# EAGLE design PIZ-Dual v886 (EAGLE 7.6.0)
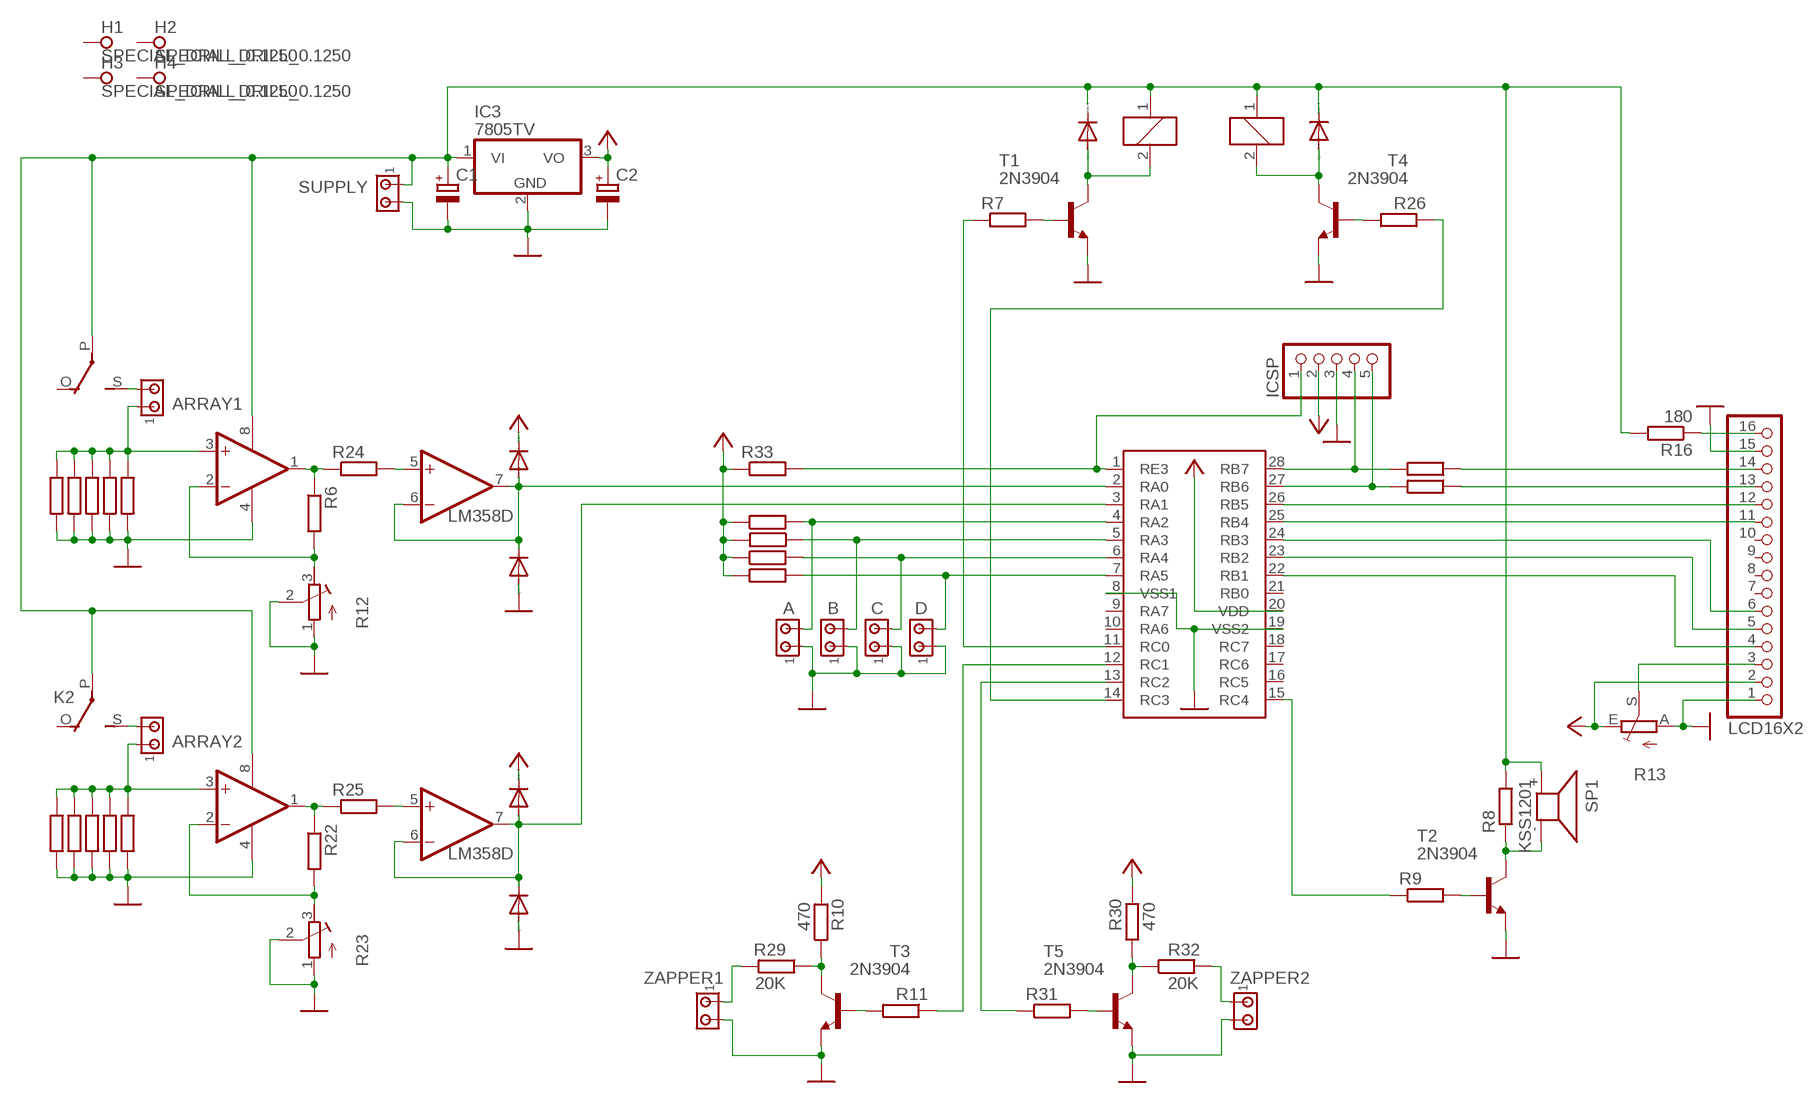
[diagram p0: schematic, sheet 1]

## Parts
A  MTA02-100  [10X02MTA]
ARRAY1  MTA02-100  [10X02MTA]
ARRAY2  MTA02-100  [10X02MTA]
B  MTA02-100  [10X02MTA]
C  MTA02-100  [10X02MTA]
C1  CPOL-EUE2.5-7  [E2,5-7]
C2  CPOL-EUE2.5-7  [E2,5-7]
D  MTA02-100  [10X02MTA]
D1  1N4148DO35-7  [DO35-7]
D2  1N4148DO35-7  [DO35-7]
D3  1N4148DO35-7  [DO35-7]
D4  1N4148DO35-7  [DO35-7]
D5  1N4148DO35-7  [DO35-7]
D6  1N4148DO35-7  [DO35-7]
H1  SPECIAL_DRILL_0.1250  [PAD_0.1250]
H2  SPECIAL_DRILL_0.1250  [PAD_0.1250]
H3  SPECIAL_DRILL_0.1250  [PAD_0.1250]
H4  SPECIAL_DRILL_0.1250  [PAD_0.1250]
IC2  LM358D  [SO08]
IC3  7805TV  [TO220V]
IC4  LM358D  [SO08]
ICSP  PINHD-1X55X2MM  [1_05X2MM]
K1  G5L  [G5LE]
K2  G5L  [G5LE]
LCD16X2  PINHD-1X16  [1X16]
R1  R-EU_R1210  [R1210]
R2  R-EU_R1210  [R1210]
R3  R-EU_R1210  [R1210]
R4  R-EU_R1210  [R1210]
R5  R-EU_R1210  [R1210]
R6  R-EU_R1206  [R1206]
R7  R-EU_R1206  [R1206]
R8  R-EU_R1210  [R1210]
R9  R-EU_R1206  [R1206]
R10  470  R-EU_R1206  [R1206]
R11  R-EU_R1206  [R1206]
R12  R-TRIMM64W  [RTRIM64W]
R13  TRIM_EU-CA6V  [CA6V]
R14  R-EU_R1206  [R1206]
R15  R-EU_R1206  [R1206]
R16  180  R-EU_R2512  [R2512]
R17  R-EU_R1210  [R1210]
R18  R-EU_R1210  [R1210]
R19  R-EU_R1210  [R1210]
R20  R-EU_R1210  [R1210]
R21  R-EU_R1210  [R1210]
R22  R-EU_R1206  [R1206]
R23  R-TRIMM64W  [RTRIM64W]
R24  R-EU_R1206  [R1206]
R25  R-EU_R1206  [R1206]
R26  R-EU_R1206  [R1206]
R27  R-EU_R1206  [R1206]
R28  R-EU_R1206  [R1206]
R29  20K  R-EU_R1206  [R1206]
R30  470  R-EU_R1206  [R1206]
R31  R-EU_R1206  [R1206]
R32  20K  R-EU_R1206  [R1206]
R33  R-EU_R1206  [R1206]
R34  R-EU_R1206  [R1206]
R35  R-EU_R1206  [R1206]
SP1  KSS1201  [KSS1201]
SUPPLY  MTA02-100  [10X02MTA]
T1  2N3904  [TO92]
T2  2N3904  [TO92]
T3  2N3904  [TO92]
T4  2N3904  [TO92]
T5  2N3904  [TO92]
U$1  PIC16F88  [SO28W]
ZAPPER1  MTA02-100  [10X02MTA]
ZAPPER2  MTA02-100  [10X02MTA]

## Nets
GND: A.1 B.1 C1.- C2.- C.1 D2.A D5.A D.1 IC2.4(P:V-) IC3.2(GND) IC4.4(P:V-) ICSP.3 LCD16X2.1 LCD16X2.15 R1.2 R2.2 R3.2 R4.2 R5.2 R12.1(A) R12.2(S) R13.A R17.2 R18.2 R19.2 R20.2 R21.2 R23.1(A) R23.2(S) SUPPLY.2 T1.3(E) T2.3(E) T3.3(E) T4.3(E) T5.3(E) U$1.8(VSS1) U$1.19(VSS2) ZAPPER1.2 ZAPPER2.2
N$1: ARRAY1.1 IC2.3(A:+IN) R1.1 R2.1 R3.1 R4.1 R5.1
N$2: ARRAY1.2 K1.S(2:S)
N$3: IC2.1(A:OUT) R6.1 R24.1
N$4: IC2.2(A:-IN) R6.2 R12.3(E)
N$5: R8.1 SP1.- T2.1(C)
N$6: D1.A D2.C IC2.6(B:-IN) IC2.7(B:OUT) U$1.2(RA0)
N$7: D3.A K1.2 T1.1(C)
N$8: R29.2 ZAPPER1.1
N$9: R7.2 T1.2(B)
N$10: R9.2 T2.2(B)
N$11: R11.2 T3.2(B)
N$12: R9.1 U$1.15(RC4)
N$13: LCD16X2.4 U$1.22(RB1)
N$14: R7.1 U$1.11(RC0)
N$15: LCD16X2.14 R27.1
N$16: LCD16X2.13 R28.1
N$17: LCD16X2.12 U$1.26(RB5)
N$18: LCD16X2.11 U$1.25(RB4)
N$19: ARRAY2.1 IC4.3(A:+IN) R17.1 R18.1 R19.1 R20.1 R21.1
N$20: R11.1 U$1.12(RC1)
N$21: LCD16X2.6 U$1.24(RB3)
N$22: LCD16X2.3 R13.S
N$23: LCD16X2.5 U$1.23(RB2)
N$24: C1.+ D6.C IC2.8(P:V+) IC3.1(VI) IC4.8(P:V+) K1.1 K1.P(2:P) K2.1 K2.P(2:P) R8.2 R16.2 SP1.+ SUPPLY.1
N$25: LCD16X2.16 R16.1
N$26: ICSP.5 R28.2 U$1.27(RB6)
N$27: ICSP.4 R27.2 U$1.28(RB7)
N$28: IC4.1(A:OUT) R22.1 R25.1
N$29: IC4.2(A:-IN) R22.2 R23.3(E)
N$30: D4.A D5.C IC4.6(B:-IN) IC4.7(B:OUT) U$1.3(RA1)
N$31: ARRAY2.2 K2.S(2:S)
N$32: IC2.5(B:+IN) R24.2
N$33: IC4.5(B:+IN) R25.2
N$34: A.2 R15.2 U$1.4(RA2)
N$35: D6.A K2.2 T4.1(C)
N$36: R26.2 T4.2(B)
N$37: R26.1 U$1.14(RC3)
N$38: R31.1 U$1.13(RC2)
N$39: R10.1 R29.1 T3.1(C)
N$40: R31.2 T5.2(B)
N$41: R32.2 ZAPPER2.1
N$43: R30.1 R32.1 T5.1(C)
N$44: ICSP.1 R33.2 U$1.1(RE3)
N$45: B.2 R14.1 U$1.5(RA3)
N$47: C.2 R34.2 U$1.6(RA4)
N$48: D.2 R35.2 U$1.7(RA5)
VCC: C2.+ D1.C D4.C IC3.3(VO) ICSP.2 LCD16X2.2 R10.2 R13.E R14.2 R15.1 R30.2 R33.1 R34.1 R35.1 U$1.20(VDD)
Unconnected: D3.C H1.1 H2.1 H3.1 H4.1 K1.O(2:O) K2.O(2:O) LCD16X2.7 LCD16X2.8 LCD16X2.9 LCD16X2.10 U$1.9(RA7) U$1.10(RA6) U$1.16(RC5) U$1.17(RC6) U$1.18(RC7) U$1.21(RB0)

## Library data of the parts
A ARRAY1 ARRAY2 B C D SUPPLY ZAPPER1 ZAPPER2 = con-amp:MTA02-100: AMP connector
C1 C2 = rcl:CPOL-EU: POLARIZED CAPACITOR, European symbol
D1-D6 = diode:1N4148: DIODE high speed (Philips)
H1-H4 = special-drill:SPECIAL_DRILL_: Special drills
IC2 IC4 = linear:LM358: OP AMP also LM158; LM258; LM2904 Source: http://cache.national.com/ds/LM/LM158.pdf
IC3 = linear:78*: Positive VOLTAGE REGULATOR Source: http://cache.national.com/ds/LM/LM78L05.pdf http://www.fairchildsemi.com/ds/LM/LM7805.pdf
ICSP = pinhead:PINHD-1X5: PIN HEADER
K1 K2 = relay:G5L: RELAY 1 x switch, 10 A/120 V AC, 8 A/30 V ADC, Omron; OC_FARNELL: unknown; OC_NEWARK: unknown
LCD16X2 = pinhead:PINHD-1X16: PIN HEADER
R1-R11 R14-R22 R24-R35 = rcl:R-EU_: RESISTOR, European symbol
R12 R23 = rcl:R-TRIMM: Trimm resistor
R13 = pot:TRIM_EU-: POTENTIOMETER
SP1 = buzzer:KSS1201: SPEAKER Source: Schukat; OC_FARNELL: unknown; OC_NEWARK: unknown
T1-T5 = transistor:2N3904: NPN TRANSISTOR
U$1 = microchip:PIC16F88*: PIC16F886 - Hecho por Cesar Gil Lao

## Board
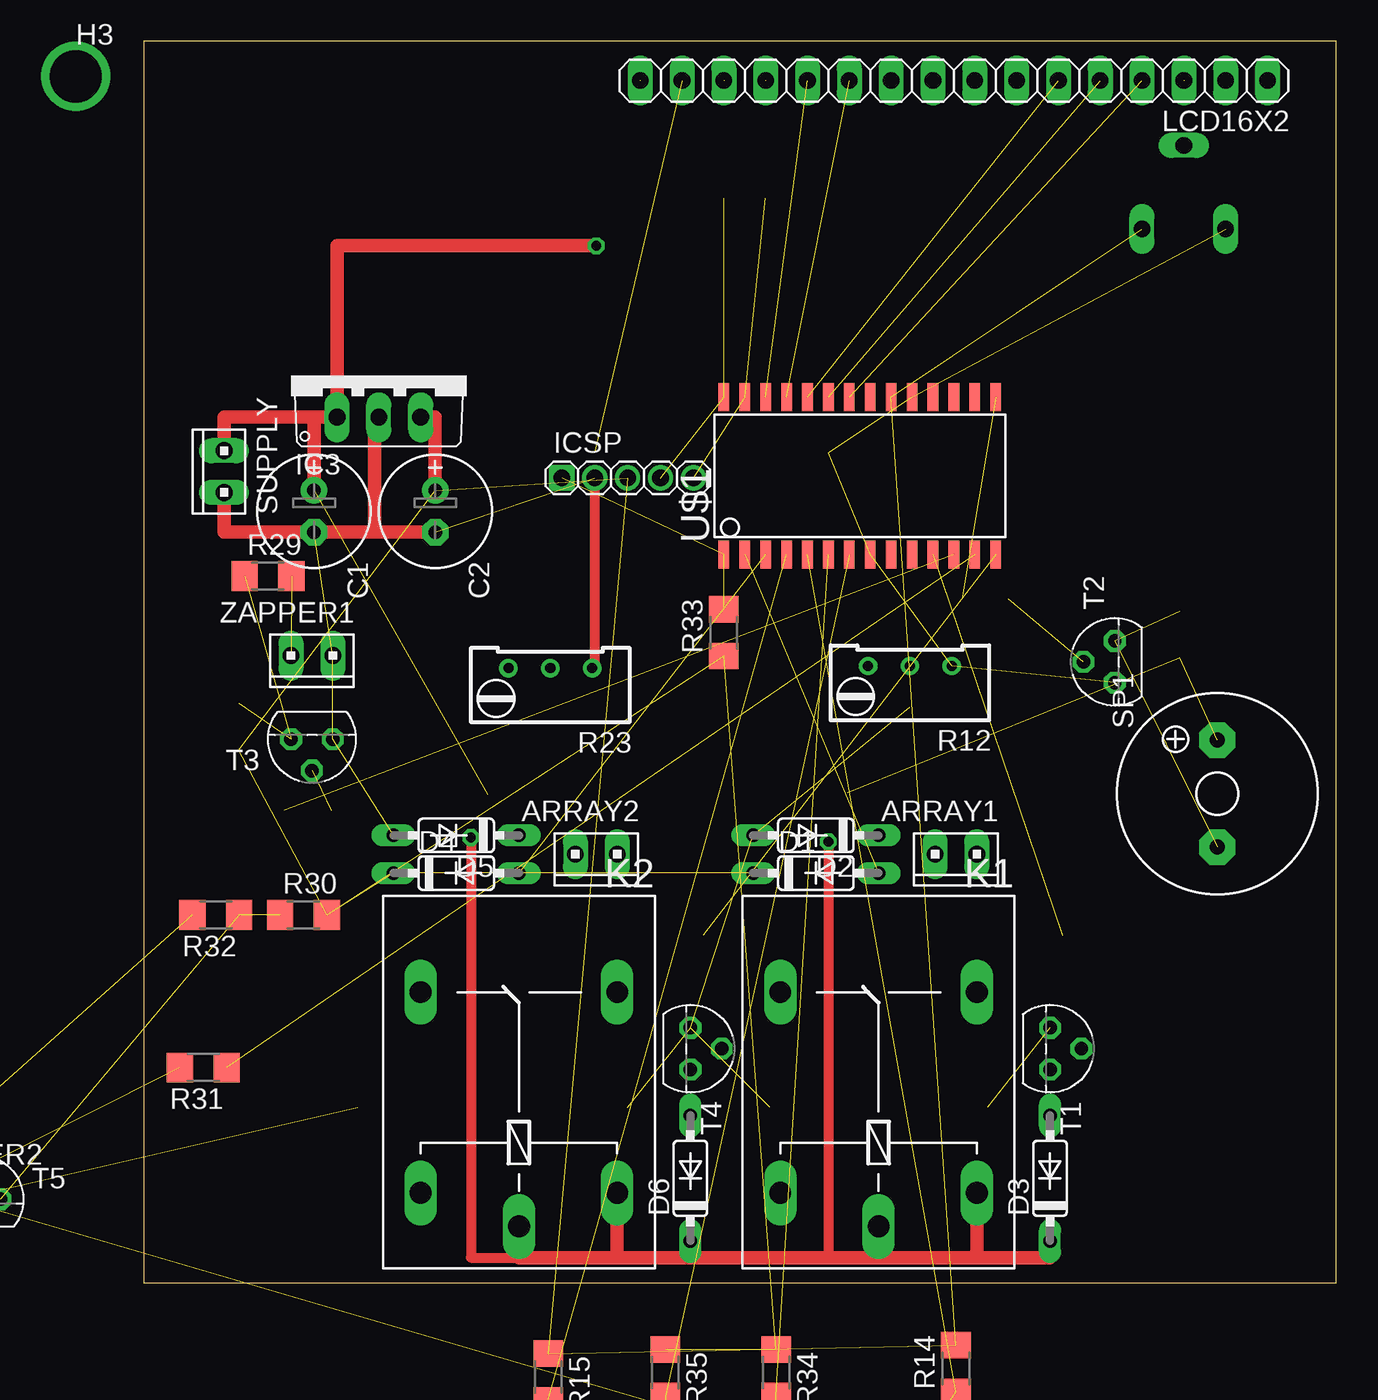
[diagram p1: board, top side]
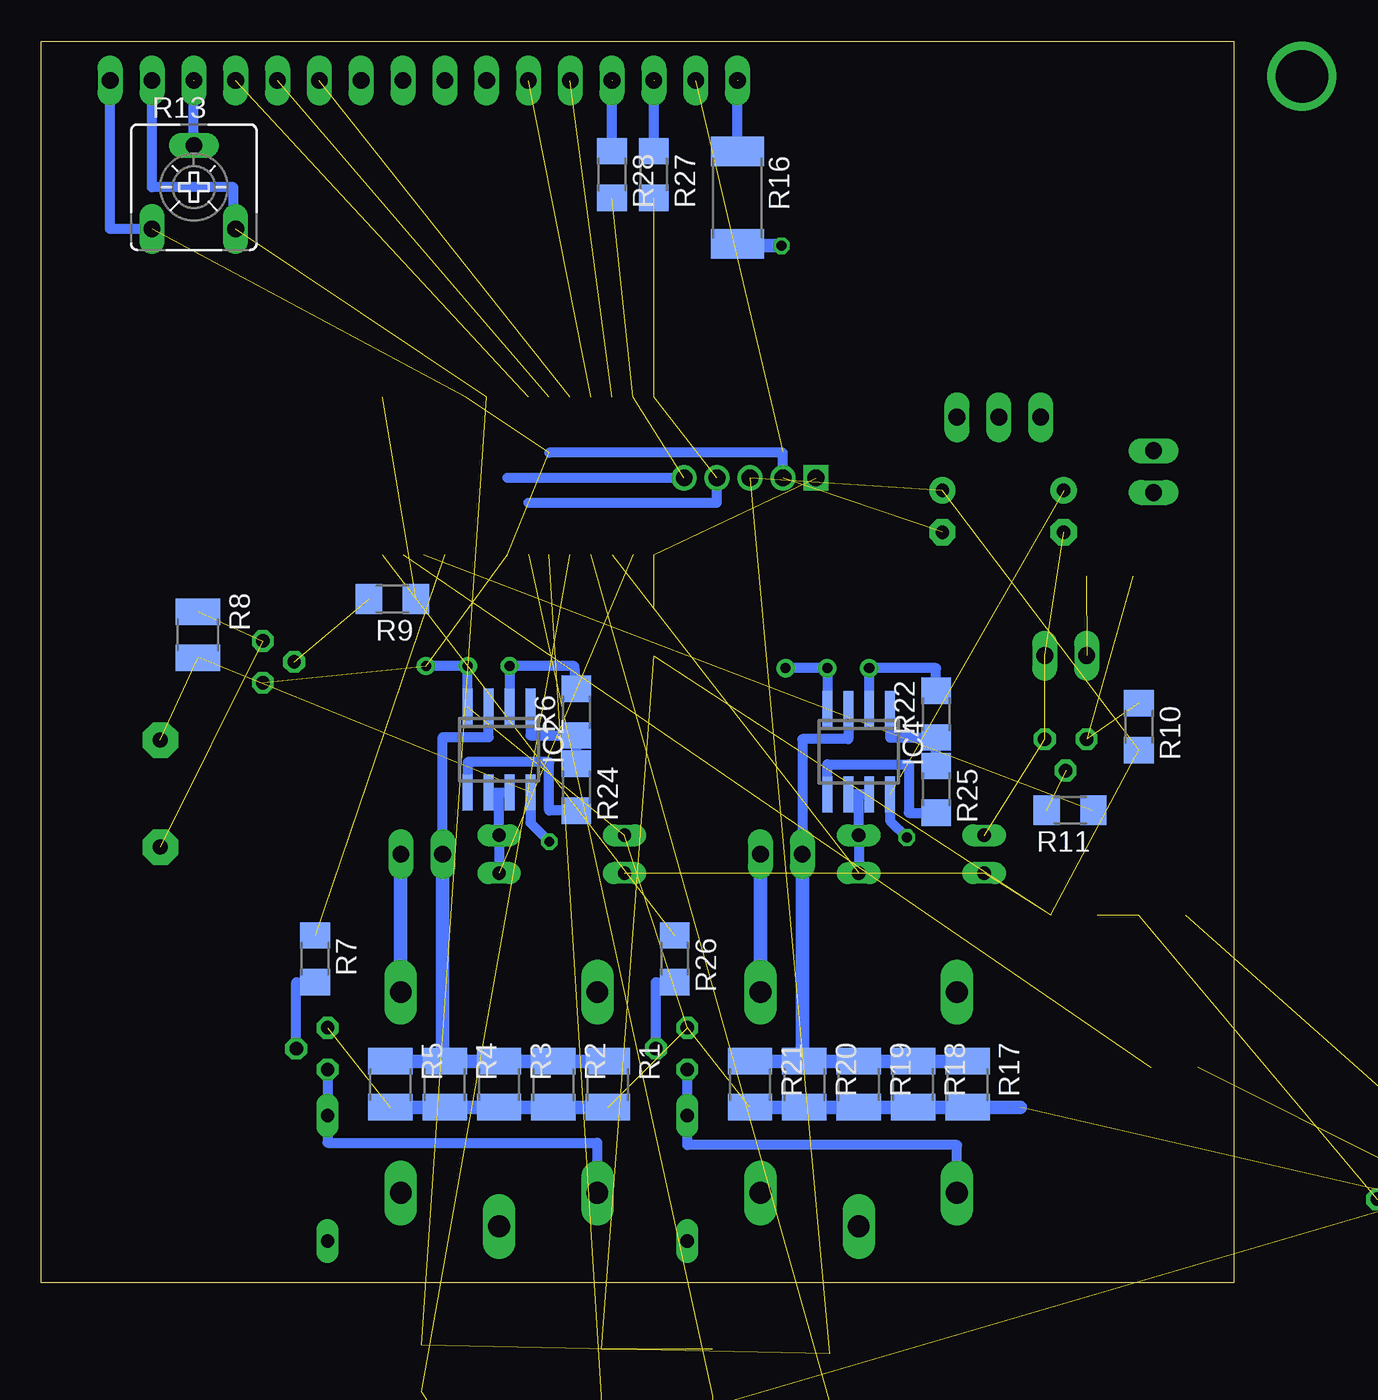
[diagram p2: board, bottom side, seen from below]

Size 72.44 x 75.42 mm. Coordinates in mm from the lower left corner, seen from the top.
Outline: 72.44,0 72.44,75.42 0,75.42 0,0 72.44,0
Copper layers (1*16): Top 0.035mm / dielectric 1.5mm / Bottom 0.035mm
Design rules "default": minimum track width 10mil, minimum drill 24mil, track to track 8mil, track to pad 8mil, pad to pad 8mil, via to via 8mil, smd to smd 8mil, copper to edge 40mil, drill to drill 8mil, minimum pad ring 10mil, minimum via ring 8mil, stop-mask expansion 4mil, vias tented up to drill 0mil, thermal gap 10mil

### Footprints (pad centres in the part's own frame; a part is rotated, then mirrored left to right if it is on the bottom)
10X02MTA = drill 1.016 long: 1 1.27,0; 2 -1.27,0
E2,5-7 = drill 0.813 pad 1.6: + -1.27,0 | drill 0.813 pad 1.6 octagon: - 1.27,0
DO35-7 = drill 0.813 long: A 3.81,0; C -3.81,0
PAD_0.1250 = drill 3.175 pad 3.175: 1 0,0
SO08 = smd 0.6 x 2.2: 1 -1.905,-2.6; 2 -0.635,-2.6; 3 0.635,-2.6; 4 1.905,-2.6; 5 1.905,2.6; 6 0.635,2.6; 7 -0.635,2.6; 8 -1.905,2.6
TO220V = drill 1.016 long: 1 -2.54,-2.54; 2 0,-2.54; 3 2.54,-2.54
1_05X2MM = drill 1.016 pad 1.3 square: 1 -4,0 | drill 1.016 pad 1.3: 2 0,0; 3 -2,0; 4 2,0; 5 4,0
G5LE = drill 1.321 long: 1 -7.493,-5.969; 2 -7.493,5.969; O 4.699,5.969; P -9.525,0; S 4.699,-5.969
1X16 = drill 1.016 long: 1 -19.05,0; 2 -16.51,0; 3 -13.97,0; 4 -11.43,0; 5 -8.89,0; 6 -6.35,0; 7 -3.81,0; 8 -1.27,0; 9 1.27,0; 10 3.81,0; 11 6.35,0; 12 8.89,0; 13 11.43,0; 14 13.97,0; 15 16.51,0; 16 19.05,0
R1210 = smd 1.6 x 2.7: 1 -1.4,0; 2 1.4,0
R1206 = smd 1.6 x 1.803: 1 -1.422,0; 2 1.422,0
RTRIM64W = drill 0.61: 1 1.27,-2.54; 2 1.27,0; 3 1.27,2.54
CA6V = drill 1.016 long: A -2.54,-2.54; E 2.54,-2.54; S 0,2.54
R2512 = smd 1.8 x 3.2: 1 -2.8,0; 2 2.8,0
KSS1201 = drill 0.914 pad 2.159 octagon: + 3.251,0; - -3.251,0
TO92 = drill 0.813 octagon: 1 1.27,0; 2 0,1.905; 3 -1.27,0
SO28W = smd 0.65 x 1.7: 1 -7.62,-4.78; 2 -6.35,-4.78; 3 -5.08,-4.78; 4 -3.81,-4.78; 5 -2.54,-4.78; 6 -1.27,-4.78; 7 0,-4.78; 8 1.27,-4.78; 9 2.54,-4.78; 10 3.81,-4.78; 11 5.08,-4.78; 12 6.35,-4.78; 13 7.62,-4.78; 14 8.89,-4.78; 15 8.89,4.78; 16 7.62,4.78; 17 6.35,4.78; 18 5.08,4.78; 19 3.81,4.78; 20 2.54,4.78; 21 1.27,4.78; 22 0,4.78; 23 -1.27,4.78; 24 -2.54,4.78; 25 -3.81,4.78; 26 -5.08,4.78; 27 -6.35,4.78; 28 -7.62,4.78

### Placement (x,y rotation side)
A  26.21,-12.19 0 top  (outside the outline)
ARRAY1  49.33,26.04 180 top
ARRAY2  27.48,26.04 180 top
B  46.91,-12.32 0 top  (outside the outline)
C  39.8,-12.7 0 top  (outside the outline)
C1  10.34,46.86 270 top
C2  17.7,46.86 270 top
D  32.94,-13.08 0 top  (outside the outline)
D1  40.82,24.89 0 top
D2  40.82,27.18 180 top
D3  55.04,6.35 90 top
D4  18.97,24.89 0 top
D5  18.97,27.18 180 top
D6  33.2,6.35 90 top
H1  -27,3.43 0 top  (outside the outline)
H2  80.7,2.67 0 top  (outside the outline)
H3  -4.14,73.28 0 top  (outside the outline)
H4  79.68,72.52 0 top  (outside the outline)
IC2  44.63,32.38 180 bottom
IC3  14.28,55.12 0 top
IC4  22.78,32.26 180 bottom
ICSP  29.39,48.9 0 top
K1  44.63,12.95 90 top
K2  22.78,12.95 90 top
LCD16X2  49.2,73.03 180 top
R1  38.02,12.06 270 bottom
R2  41.33,12.06 270 bottom
R3  44.63,12.06 270 bottom
R4  47.93,12.06 270 bottom
R5  51.23,12.06 270 bottom
R6  39.93,34.67 90 bottom
R7  55.8,19.68 270 bottom
R8  62.92,39.37 270 bottom
R9  51.11,41.53 180 bottom
R10  5.77,33.78 270 bottom
R11  9.96,28.7 180 bottom
R12  46.53,36.2 90 top
R13  63.17,66.55 0 bottom
R14  49.33,-5.21 90 top  (outside the outline)
R15  24.56,-5.71 270 top  (outside the outline)
R16  30.15,65.91 270 bottom
R17  16.18,12.06 270 bottom
R18  19.48,12.06 270 bottom
R19  22.78,12.06 270 bottom
R20  26.09,12.06 270 bottom
R21  29.39,12.06 270 bottom
R22  18.09,34.54 90 bottom
R23  24.69,36.07 90 top
R24  39.93,30.1 270 bottom
R25  18.09,29.97 270 bottom
R26  33.96,19.68 270 bottom
R27  35.23,67.31 270 bottom
R28  37.77,67.31 270 bottom
R29  7.54,42.93 0 top
R30  9.7,22.35 0 top
R31  3.61,13.08 180 top
R32  4.37,22.35 180 top
R33  35.23,39.5 90 top
R34  38.41,-5.46 270 top  (outside the outline)
R35  31.67,-5.46 270 top  (outside the outline)
SP1  65.2,29.72 90 top
SUPPLY  4.88,49.28 90 top
T1  55.04,14.22 270 top
T2  58.98,37.72 90 top
T3  10.21,33.02 180 top
T4  33.2,14.22 270 top
T5  -9.98,5.08 0 top  (outside the outline)
U$1  42.85,49.02 0 top
ZAPPER1  10.21,38.1 180 top
ZAPPER2  -11.76,10.41 0 top  (outside the outline)

### Tracks (layer width: path | path; a pad name or v marks a point on that pad's centre or on a via)
GND  (21 unrouted)
  Top 0.61: ICSP.3 27.39,37.34 R23.1
  Top 0.813: C2.- 14.02,45.59 | 14.02,45.59 C1.- 4.88,45.59 SUPPLY.2 | IC3.2 14.02,52.58 14.02,45.59
  Bottom 0.61: IC2.4 R12.2 R12.1 | IC4.4 R23.2 R23.1 | R13.A 68.25,64.01 LCD16X2.1 | ICSP.3 27.39,50.42 41.58,50.42
  Bottom 0.813: R5.2 R4.2 R3.2 R2.2 R1.2 | R21.2 R20.2 R19.2 R18.2 R17.2 12.98,10.66
N$1
  Bottom 0.61: ARRAY1.1 48.06,33.15 45.26,33.15 IC2.3
  Bottom 0.813: R4.1 R5.1 50.6,13.34 | R4.1 R3.1 R2.1 R1.1 | ARRAY1.1 48.06,13.34 R4.1
N$2
  Bottom 0.813: ARRAY1.2 K1.S
N$3
  Bottom 0.61: R24.1 R6.1 42.72,33.25 IC2.1
N$4
  Bottom 0.61: R6.2 40.06,37.47 R12.3 IC2.2
N$5  (2 unrouted)
N$6  (1 unrouted)
  Bottom 0.61: IC2.6 44.63,29.79 | 44.63,29.79 IC2.7 | D1.A D2.C 44.63,29.79
N$7
  Bottom 0.61: K1.2 38.66,8.51 55.04,8.51 D3.A T1.1
N$8  (1 unrouted)
N$9
  Bottom 0.61: T1.2 56.95,18.26 R7.2
N$10  (1 unrouted)
N$11  (1 unrouted)
N$12  (1 unrouted)
N$13  (1 unrouted)
N$14  (1 unrouted)
N$15  (1 unrouted)
  Bottom 0.61: R27.1 LCD16X2.14
N$16  (1 unrouted)
  Bottom 0.61: R28.1 LCD16X2.13
N$17  (1 unrouted)
N$18  (1 unrouted)
N$19
  Bottom 0.61: IC4.3 23.42,33.02 26.21,33.02 ARRAY2.1
  Bottom 0.813: R21.1 R20.1 | R20.1 R19.1 R18.1 R17.1 | ARRAY2.1 26.21,13.34 R20.1
N$20  (1 unrouted)
N$21  (1 unrouted)
  Bottom 0.61: LCD16X2.6
N$22  (1 unrouted)
  Bottom 0.61: R13.S LCD16X2.3
N$23  (1 unrouted)
  Bottom 0.61: LCD16X2.5
N$24  (via drill 0.6)  (3 unrouted)
  Top 0.61: v41.58,26.8 41.58,1.52 | v19.86,27.05 19.86,1.52 23.29,1.52
  Top 0.813: 50.6,1.52 44.63,1.52 | 44.63,1.52 41.58,1.52 33.07,1.52 | 33.07,1.52 28.75,1.52 | 28.75,1.52 23.29,1.52 22.78,1.52 K2.P | D6.C 33.07,2.54 33.07,1.52 | K1.P 44.63,1.52 | 28.75,1.52 K2.1 | 55.04,1.52 50.6,1.52 | 50.6,1.52 K1.1 | SUPPLY.1 4.88,52.58 10.34,52.58 | 10.34,52.58 IC3.1 11.73,62.99 v27.48,62.99 | C1.+ 10.34,52.58
  Bottom 0.61: IC2.8 42.72,27.94 v41.58,26.8 | IC4.8 20.88,28.07 v19.86,27.05
  Bottom 0.813: v27.48,62.99 30.15,62.99 R16.2
N$25  (1 unrouted)
  Bottom 0.61: R16.1 LCD16X2.16
N$26  (2 unrouted)
  Bottom 0.61: ICSP.5 44.12,48.9
N$27  (2 unrouted)
  Bottom 0.61: ICSP.4 31.42,48.51 31.42,47.37 42.85,47.37
N$28
  Bottom 0.61: R25.1 R22.1 20.88,33.12 IC4.1
N$29
  Bottom 0.61: IC4.2 R23.3 18.09,37.34 R22.2
N$30  (1 unrouted)
  Bottom 0.61: IC4.7 22.78,29.66 | 22.78,29.66 IC4.6 | D4.A D5.C 22.78,29.66
N$31
  Bottom 0.813: ARRAY2.2 K2.S
N$32
  Bottom 0.61: R24.2 41.58,28.68 41.58,31.62 46.53,31.62 IC2.5
N$33
  Bottom 0.61: IC4.5 24.69,31.5 19.74,31.5 19.74,28.55 R25.2
N$34  (2 unrouted)
N$35
  Bottom 0.61: T4.1 D6.A 33.2,8.38 16.81,8.38 K2.2
N$36
  Bottom 0.61: T4.2 35.1,18.26 R26.2
N$37  (1 unrouted)
N$38  (1 unrouted)
N$39  (2 unrouted)
N$40  (1 unrouted)
N$41  (1 unrouted)
N$43  (2 unrouted)
N$44  (2 unrouted)
N$45  (2 unrouted)
N$47  (2 unrouted)
N$48  (2 unrouted)
VCC  (12 unrouted)
  Top 0.813: C2.+ 17.7,52.58 IC3.3
  Bottom 0.61: R13.E 60.76,64.01 60.76,66.55 65.71,66.55 LCD16X2.2